# Altium schematic sheet Sheet3.SchDoc
size A4
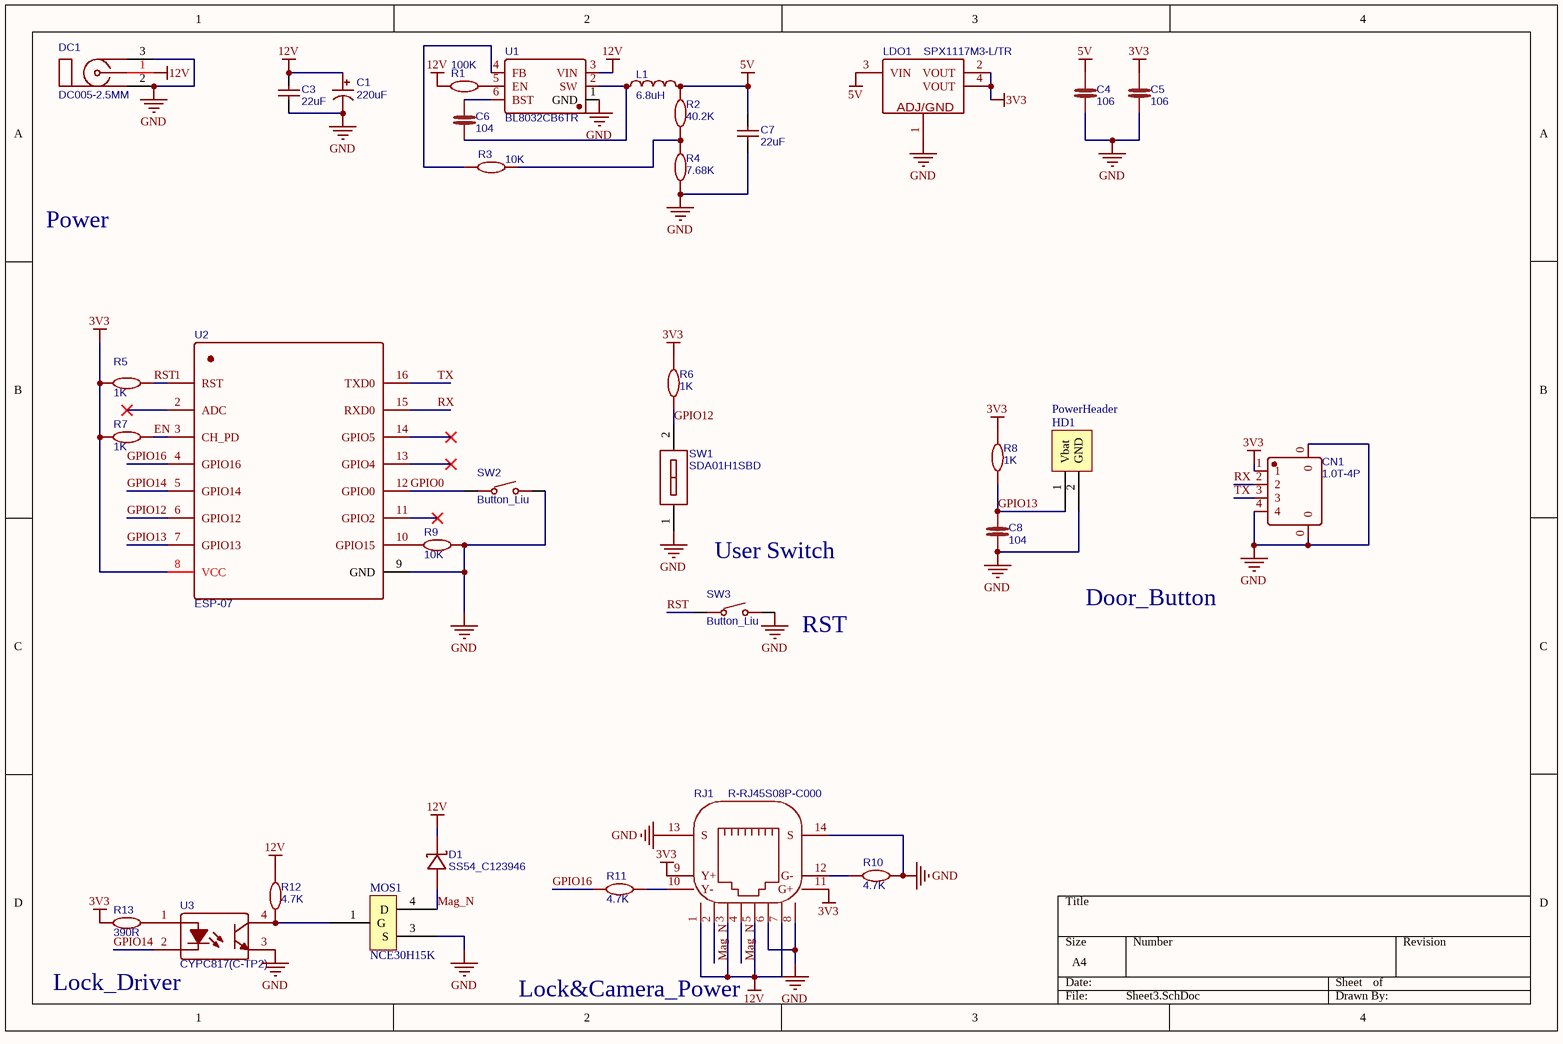
[diagram p0: Sheet3.SchDoc]

## Parts
C1  220uF  [CAP-SMD_BD10.0-L10.3-W10.3-FD]
C3  22uF  [0805]
C4  106  [0805]
C5  106  [0805]
C6  104  [0402]
C7  22uF  [0805]
C8  104  [0402]
CN1  1.0T-4P  [1.0T-4P-LT]
D1  SS54_C123946  [SMA_L4.4-W2.8-LS5.4-RD]
DC1  DC005-2.5MM  [DC-5020]
HD1  PowerHeader  [PowerHeader]
L1  6.8uH  [L-SMD-6.0X6.0X4.7]
LDO1  SPX1117M3-L/TR  [SOT-223]
MOS1  NCE30H15K  [DPAK228P970X238-3N]
R1  100K  [0402]
R2  40.2K  [0402]
R3  10K  [0402]
R4  7.68K  [0402]
R5  1K  [0402]
R6  1K  [0402]
R7  1K  [0402]
R8  1K  [0402]
R9  10K  [0402]
R10  4.7K  [0402]
R11  4.7K  [0402]
R12  4.7K  [0402]
R13  390R  [0402]
RJ1  R-RJ45S08P-C000  [RJ45-TH_12PIN_R-RJ45S08P-C000_PITCH2.54-TL]
SW1  SDA01H1SBD  [SDA01H1SBD]
SW2  Button_Liu  [SW-SMD_L6.0-W3.5-LS8.0]
SW3  Button_Liu  [SW-SMD_L6.0-W3.5-LS8.0]
U1  BL8032CB6TR  [SOT-23-6]
U2  ESP-07  [ESP-07]
U3  CYPC817(C-TP2)  [SOP-4_4PIN-L4.83-W10.20-PITCH2.54-BL]

## Nets
3V3: C5.1 CN1.1 LDO1.2(VOUT) LDO1.4(VOUT) R5.1 R6.2 R7.1 R8.2 R13.2 RJ1.9(Y+) RJ1.11(G+) U2.8(VCC)
5V: C4.1 C7.2 L1.2 LDO1.3(VIN) R2.1
12V: C1.1 C3.2 D1.1(K) DC1.1(VCC) R1.2 R12.1 RJ1.1 RJ1.3 RJ1.5 RJ1.7 U1.3(VIN)
GND: C1.2 C3.1 C4.2 C5.2 C7.1 C8.2 CN1.0 CN1.4 DC1.2 DC1.3 HD1.2(GND) LDO1.1(ADJ) MOS1.3(S) R4.2 R9.2 R10.2 RJ1.6 RJ1.8 RJ1.13(S) RJ1.14(S) SW1.1(A1) SW2.2 SW3.2 U1.1(GND) U2.9(GND) U3.3(EMI)
EN: R7.2 U2.3(CH_PD)
GPIO0: SW2.1 U2.12(GPIO0)
GPIO12: R6.1 SW1.2(B1) U2.6(GPIO12)
GPIO13: C8.1 HD1.1(Vbat) R8.1 U2.7(GPIO13)
GPIO14: U2.5(GPIO14) U3.2(CAT)
GPIO16: R11.1 U2.4(GPIO16)
Mag_N: D1.2(A) MOS1.4(D) RJ1.2 RJ1.4
RST: R5.2 SW3.1 U2.1(RST)
RX: CN1.2 U2.15(RXD0)
TX: CN1.3 U2.16(TXD0)
NetC6_1: C6.1 L1.1 U1.2(SW)
NetC6_2: C6.2 U1.6(BST)
NetMOS1_1: MOS1.1(G) R12.2 U3.4(COL)
NetR1_1: R1.1 U1.5(EN)
NetR2_2: R2.2 R3.1 R4.1
NetR3_2: R3.2 U1.4(FB)
NetR9_1: R9.1 U2.10(GPIO15)
NetR10_1: R10.1 RJ1.12(G-)
NetR11_2: R11.2 RJ1.10(Y-)
NetR13_1: R13.1 U3.1(AN)

Not connected (* = marked no-connect by the designer): U2 2(ADC)* 11(GPIO2)* 13(GPIO4)* 14(GPIO5)*

## Notes on the sheet
- Power
- User Switch
- (near SW3) RST
- Door_Button
- (near U3) Lock_Driver
- Lock&Camera_Power
- (in symbol SPX1117M3-L/TR) ADJ/GND

## Library data of the parts
C1 = 220uF: BOM_Manufacturer: HONOR; BOM_Manufacturer Part: RVT1H221M1010; nameAlias: Capacitance; BOM_Supplier: LCSC; BOM_Supplier Part: C3358; spicePre: C; spiceSymbolName: RVT1H221M1010-C3358
C3 C7 = 1uF: BOM_Manufacturer: TAIYO YUDEN; BOM_Manufacturer Part: TMK212BJ105KG-T; nameAlias: Capacitance; BOM_Supplier: LCSC; BOM_Supplier Part: C92829; spicePre: C; spiceSymbolName: TMK212BJ105KG-T
C4-C6 C8 = 0.1UF-16V(+-10%)(0402): Contributor: SparkFun; BOM_Manufacturer Part: ?; spicePre: C
CN1 = 1.0T-4P: BOM_Manufacturer: Boom Precision Elec; Contributor: LCSC; BOM_Supplier: LCSC; BOM_Supplier Part: C145961; BOM_Manufacturer Part: -; spicePre: C
D1 = SS54_C123946: BOM_Manufacturer: Jingdao; BOM_Manufacturer Part: SS54; Contributor: LCSC; SMT Type: Extend; BOM_Supplier: LCSC; BOM_Supplier Part: C123946; BOM_LCSC Assembly: Yes; spicePre: D; spiceSymbolName: SS54_C123946
DC1 = DC005-2.5MM: BOM_Manufacturer: SOFNG; BOM_Supplier: LCSC; BOM_Manufacturer Part: DC005-2.5MM; BOM_Supplier Part: C111573; spicePre: D
L1 = 6.8uH: BOM_Manufacturer: CENKER; BOM_Manufacturer Part: CKCS6045-6.8uH/M; nameAlias: Value; Contributor: LCSC; BOM_Supplier: LCSC; BOM_Supplier Part: C354631; spicePre: L; spiceSymbolName: CKCS6045-6.8UH/M
LDO1 = SPX1117M3-L/TR: BOM_Manufacturer: EXAR; SMT Type: Extend; BOM_Supplier: LCSC; BOM_Manufacturer Part: SPX1117M3-L/TR; image: //image.lceda.cn/szlcsc/C67402.jpg; BOM_Supplier Part: C67402; BOM_LCSC Assembly: Yes; spicePre: L; spiceSymbolName: SPX1117M3-L/TR
MOS1 = IRLR7843
R1-R13 = 1K: BOM_Manufacturer: KAMAYA; BOM_Manufacturer Part: RMC1/16S-102JTH-M; nameAlias: Resistance (Ohms); Contributor: LCSC; BOM_Supplier: LCSC; BOM_Supplier Part: C340521; spicePre: R; spiceSymbolName: RMC1/16S-102JTH-M
RJ1 = R-RJ45S08P-C000: BOM_Manufacturer: Shenzhen Cankemeng; Contributor: LCSC; BOM_Supplier: LCSC; BOM_Supplier Part: C386764; BOM_Manufacturer Part: R-RJ45S08P-C000; spicePre: R; spiceSymbolName: R-RJ45S08P-C000
SW1 = SDA01H1SBD: BOM_Manufacturer: C&K; Contributor: LCSC; BOM_Supplier: LCSC; BOM_Supplier Part: C221944; BOM_Manufacturer Part: SDA01H1SBD; spicePre: S; spiceSymbolName: SDA01H1SBD
SW2 SW3 = Button_Liu: BOM_Manufacturer: XKB Enterprise; BOM_Manufacturer Part: TS-1101S-C-B-B-W-X; Contributor: LCSC; BOM_Supplier: LCSC; BOM_Supplier Part: C318937; spicePre: S; spiceSymbolName: TS-1101S-C-B-B-W-X
U1 = BL8032CB6TR: BOM_Manufacturer: BL; Contributor: LCSC; BOM_Supplier: LCSC; BOM_Manufacturer Part: BL8032CB6TR; BOM_Supplier Part: C93180; spicePre: U
U2 = ESP-07: BOM_Manufacturer: Ai-Thinker; BOM_Supplier: LCSC; BOM_Manufacturer Part: ESP-07; BOM_Supplier Part: C82894; spicePre: U
U3 = CYPC817(C-TP2): BOM_Manufacturer: OCIC; Contributor: LCSC; BOM_Supplier: LCSC; BOM_Supplier Part: C385058; BOM_Manufacturer Part: CYPC817(C-TP2); spicePre: U